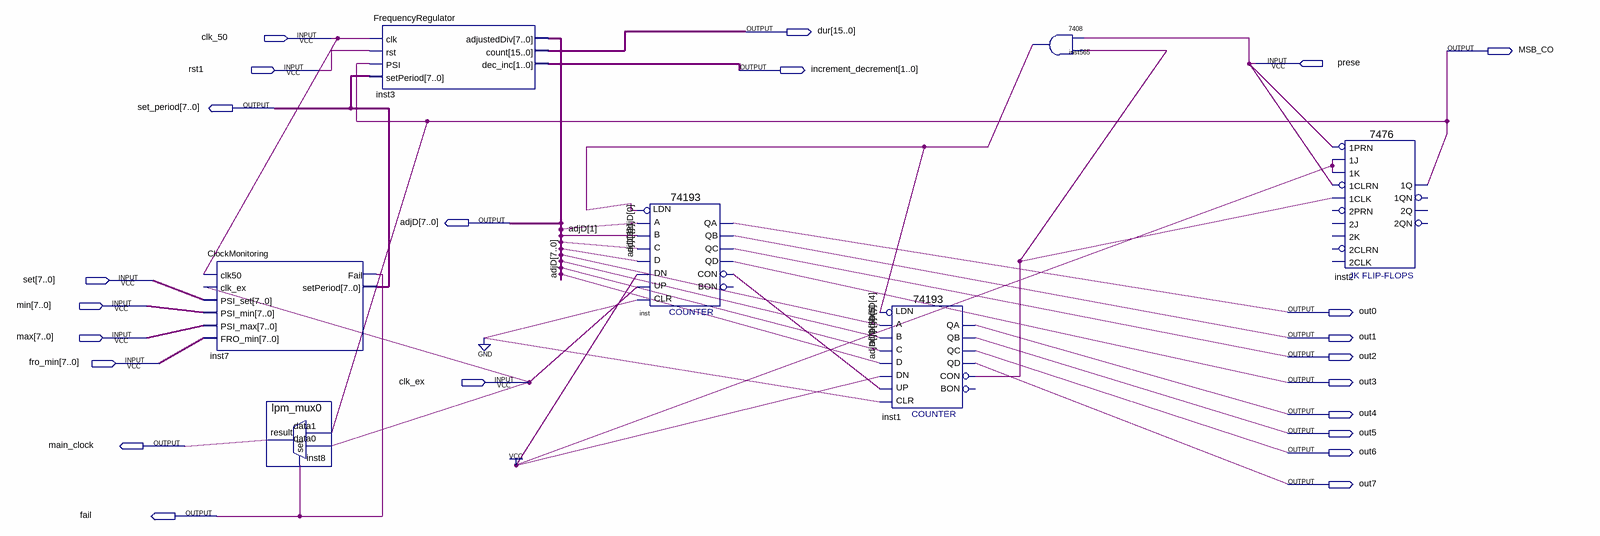
[diagram p0: schematic sheet]
// Quartus schematic fc2.bdf as structural Verilog: 7 symbols, 23 pins
module fc2 (
  input  clk_50,
  input  prese,
  input  rst1,
  input  [7:0] set,
  input  [7:0] min,
  input  [7:0] max,
  input  [7:0] fro_min,
  input  clk_ex,
  output [15:0] dur,
  output MSB_CO,
  output [1:0] increment_decrement,
  output [7:0] set_period,
  output [7:0] adjD,
  output out0,
  output out1,
  output out2,
  output out3,
  output out4,
  output out5,
  output main_clock,
  output out6,
  output out7,
  output fail
);

  wire inst1_con, inst565_1, inst_con;

  ClockMonitoring inst7 (
    .clk50(clk_50), .clk_ex(clk_ex), .PSI_set(set), .PSI_min(min), .PSI_max(max), .FRO_min(fro_min),
    .Fail(fail), .setPeriod(set_period));
  lpm_mux0 inst8 (.data1(MSB_CO), .data0(clk_ex), .sel(fail), .result(main_clock));
  FrequencyRegulator inst3 (
    .clk(clk_50), .rst(rst1), .PSI(MSB_CO), .setPeriod(set_period), .adjustedDiv(adjD), .count(dur),
    .dec_inc(increment_decrement));
  \74193  inst (
    .D(adjD[3]), .C(adjD[2]), .B(adjD[1]), .A(adjD[0]), .CLR(1'b0), .UP(clk_ex), .DN(1'b1), .LDN(inst565_1),
    .QB(out1), .QA(out0), .CON(inst_con), .QD(out3), .QC(out2));  // open: BON
  \74193  inst1 (
    .D(adjD[7]), .C(adjD[6]), .B(adjD[5]), .A(adjD[4]), .CLR(1'b0), .UP(inst_con), .DN(1'b1),
    .LDN(inst565_1), .QB(out5), .QA(out4), .CON(inst1_con), .QD(out7), .QC(out6));  // open: BON
  \7408  inst565 (.\3 (inst1_con), .\2 (prese), .\1 (inst565_1));
  \7476  inst2 (
    .\1J (1'b1), .\1K (1'b1), .\1PRN (prese), .\1CLK (inst1_con), .\1CLRN (prese), .\1Q (MSB_CO));  // open: 2PRN, 2J, 2K, 2CLRN, 2CLK, 2QN, 2Q, 1QN
endmodule
